# Altium schematic sheet ResistorPatch1.SchDoc
size A4
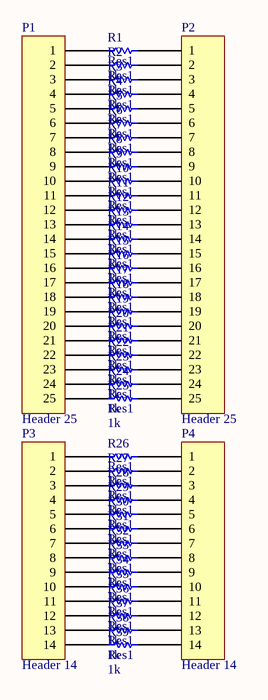
[diagram p0: ResistorPatch1.SchDoc]

## Parts
P1  Header 25  [HDR1X25]
P2  Header 25  [HDR1X25H]
P3  Header 14  [HDR1X14]
P4  Header 14  [HDR1X14H]
R1  Res1  value 1k  [AXIAL-0.4]
R2  Res1  value 1k  [AXIAL-0.4]
R3  Res1  value 1k  [AXIAL-0.4]
R4  Res1  value 1k  [AXIAL-0.4]
R5  Res1  value 1k  [AXIAL-0.4]
R6  Res1  value 1k  [AXIAL-0.4]
R7  Res1  value 1k  [AXIAL-0.4]
R8  Res1  value 1k  [AXIAL-0.4]
R9  Res1  value 1k  [AXIAL-0.4]
R10  Res1  value 1k  [AXIAL-0.4]
R11  Res1  value 1k  [AXIAL-0.4]
R12  Res1  value 1k  [AXIAL-0.4]
R13  Res1  value 1k  [AXIAL-0.4]
R14  Res1  value 1k  [AXIAL-0.4]
R15  Res1  value 1k  [AXIAL-0.4]
R16  Res1  value 1k  [AXIAL-0.4]
R17  Res1  value 1k  [AXIAL-0.4]
R18  Res1  value 1k  [AXIAL-0.4]
R19  Res1  value 1k  [AXIAL-0.4]
R20  Res1  value 1k  [AXIAL-0.4]
R21  Res1  value 1k  [AXIAL-0.4]
R22  Res1  value 1k  [AXIAL-0.4]
R23  Res1  value 1k  [AXIAL-0.4]
R24  Res1  value 1k  [AXIAL-0.4]
R25  Res1  value 1k  [AXIAL-0.4]
R26  Res1  value 1k  [AXIAL-0.4]
R27  Res1  value 1k  [AXIAL-0.4]
R28  Res1  value 1k  [AXIAL-0.4]
R29  Res1  value 1k  [AXIAL-0.4]
R30  Res1  value 1k  [AXIAL-0.4]
R31  Res1  value 1k  [AXIAL-0.4]
R32  Res1  value 1k  [AXIAL-0.4]
R33  Res1  value 1k  [AXIAL-0.4]
R34  Res1  value 1k  [AXIAL-0.4]
R35  Res1  value 1k  [AXIAL-0.4]
R36  Res1  value 1k  [AXIAL-0.4]
R37  Res1  value 1k  [AXIAL-0.4]
R38  Res1  value 1k  [AXIAL-0.4]
R39  Res1  value 1k  [AXIAL-0.4]

## Nets
NetP1_1: P1.1 R1.1
NetP1_2: P1.2 R2.1
NetP1_3: P1.3 R3.1
NetP1_4: P1.4 R4.1
NetP1_5: P1.5 R5.1
NetP1_6: P1.6 R6.1
NetP1_7: P1.7 R7.1
NetP1_8: P1.8 R8.1
NetP1_9: P1.9 R9.1
NetP1_10: P1.10 R10.1
NetP1_11: P1.11 R11.1
NetP1_12: P1.12 R12.1
NetP1_13: P1.13 R13.1
NetP1_14: P1.14 R14.1
NetP1_15: P1.15 R15.1
NetP1_16: P1.16 R16.1
NetP1_17: P1.17 R17.1
NetP1_18: P1.18 R18.1
NetP1_19: P1.19 R19.1
NetP1_20: P1.20 R20.1
NetP1_21: P1.21 R21.1
NetP1_22: P1.22 R22.1
NetP1_23: P1.23 R23.1
NetP1_24: P1.24 R24.1
NetP1_25: P1.25 R25.1
NetP2_1: P2.1 R1.2
NetP2_2: P2.2 R2.2
NetP2_3: P2.3 R3.2
NetP2_4: P2.4 R4.2
NetP2_5: P2.5 R5.2
NetP2_6: P2.6 R6.2
NetP2_7: P2.7 R7.2
NetP2_8: P2.8 R8.2
NetP2_9: P2.9 R9.2
NetP2_10: P2.10 R10.2
NetP2_11: P2.11 R11.2
NetP2_12: P2.12 R12.2
NetP2_13: P2.13 R13.2
NetP2_14: P2.14 R14.2
NetP2_15: P2.15 R15.2
NetP2_16: P2.16 R16.2
NetP2_17: P2.17 R17.2
NetP2_18: P2.18 R18.2
NetP2_19: P2.19 R19.2
NetP2_20: P2.20 R20.2
NetP2_21: P2.21 R21.2
NetP2_22: P2.22 R22.2
NetP2_23: P2.23 R23.2
NetP2_24: P2.24 R24.2
NetP2_25: P2.25 R25.2
NetP3_1: P3.1 R26.1
NetP3_2: P3.2 R27.1
NetP3_3: P3.3 R28.1
NetP3_4: P3.4 R29.1
NetP3_5: P3.5 R30.1
NetP3_6: P3.6 R31.1
NetP3_7: P3.7 R32.1
NetP3_8: P3.8 R33.1
NetP3_9: P3.9 R34.1
NetP3_10: P3.10 R35.1
NetP3_11: P3.11 R36.1
NetP3_12: P3.12 R37.1
NetP3_13: P3.13 R38.1
NetP3_14: P3.14 R39.1
NetP4_1: P4.1 R26.2
NetP4_2: P4.2 R27.2
NetP4_3: P4.3 R28.2
NetP4_4: P4.4 R29.2
NetP4_5: P4.5 R30.2
NetP4_6: P4.6 R31.2
NetP4_7: P4.7 R32.2
NetP4_8: P4.8 R33.2
NetP4_9: P4.9 R34.2
NetP4_10: P4.10 R35.2
NetP4_11: P4.11 R36.2
NetP4_12: P4.12 R37.2
NetP4_13: P4.13 R38.2
NetP4_14: P4.14 R39.2

## Library data of the parts
P1 P2 = Header 25: Header, 25-Pin; LatestRevisionDate: 17-Jul-2002; LatestRevisionNote: Re-released for DXP Platform.; Publisher: Altium Limited
P3 P4 = Header 14: Header, 14-Pin; LatestRevisionDate: 17-Jul-2002; LatestRevisionNote: Re-released for DXP Platform.; Publisher: Altium Limited
R1-R39 = Res1: Resistor; Published: 8-Jun-2000; LatestRevisionDate: 17-Jul-2002; LatestRevisionNote: Re-released for DXP Platform.; PackageReference: AXIAL-0.3; Publisher: Altium Limited; PackageDescription: Axial Device, Thru-Hole; 2 Leads; 0.3 in Pin Spacing